# EAGLE design ESP-Breakout Bd (EAGLE 8.2.2)
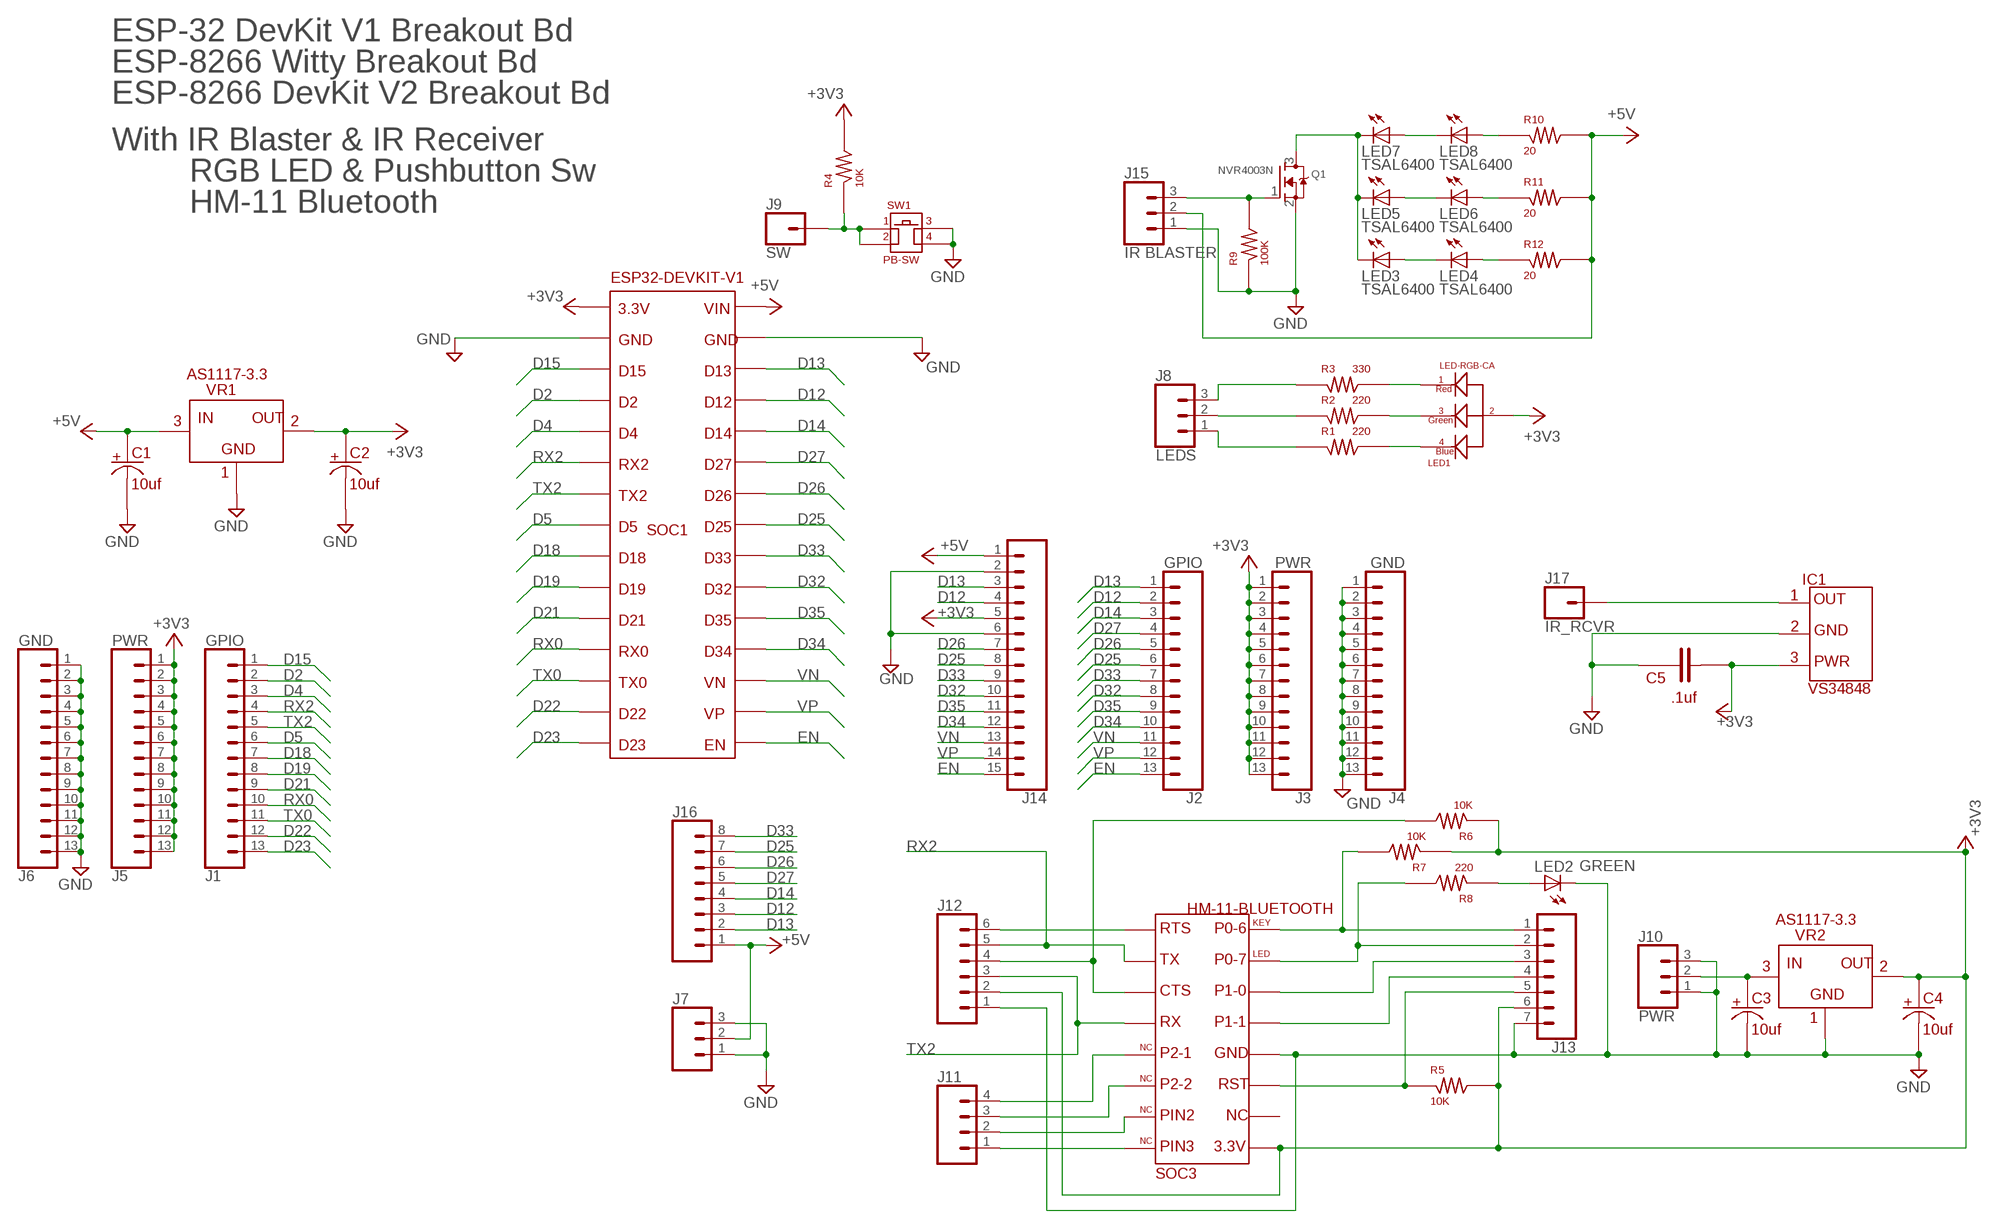
[diagram p0: schematic, sheet 1]

## Parts
C1  10uf  CAP-POL-SMT-B  [SMT-B]
C2  10uf  CAP-POL-SMT-B  [SMT-B]
C3  10uf  CAP-POL-SMT-B  [SMT-B]
C4  10uf  CAP-POL-SMT-B  [SMT-B]
C5  .1uf  NPCAP-2.5MM-ROUND  [CAP-2.5MM-ROUND]
IC1  VS34848  [VS34838]
J1  GPIO  CONN_13  [1X13]
J2  GPIO  CONN_13  [1X13]
J3  PWR  CONN_13  [1X13]
J4  GND  CONN_13  [1X13]
J5  PWR  CONN_13  [1X13]
J6  GND  CONN_13  [1X13]
J7  CONN_03  [1X03]
J8  LEDS  CONN_03  [1X03]
J9  SW  CONN_01  [1X01]
J10  PWR  CONN_03  [1X03]
J11  CONN_04  [1X04]
J12  CONN_06SILK_FEMALE_PTH  [1X06]
J13  CONN_07  [1X07]
J14  CONN_15  [1X15]
J15  IR BLASTER  CONN_03  [1X03]
J16  CONN_08"  [1X08]
J17  IR_RCVR  CONN_01  [1X01]
LED1  LED-RGB-CA  [LED-RGB-5MM]
LED2  GREEN  LEDCHIPLED_0805  [CHIPLED_0805]
LED3  TSAL6400  LED5MM  [LED5MM]
LED4  TSAL6400  LED5MM  [LED5MM]
LED5  TSAL6400  LED5MM  [LED5MM]
LED6  TSAL6400  LED5MM  [LED5MM]
LED7  TSAL6400  LED5MM  [LED5MM]
LED8  TSAL6400  LED5MM  [LED5MM]
Q1  NVR4003N  MOSFET-NREFLOW  [SOT23]
R1  220  RESISTOR-1206-TOP  [SMT-1206-TOP]
R2  220  RESISTOR-1206-TOP  [SMT-1206-TOP]
R3  330  RESISTOR-1206-TOP  [SMT-1206-TOP]
R4  10K  RESISTOR-1206-TOP  [SMT-1206-TOP]
R5  10K  RESISTOR-SMT-0603  [SMT-0603]
R6  10K  RESISTOR-SMT-0603  [SMT-0603]
R7  10K  RESISTOR-SMT-0603  [SMT-0603]
R8  220  RESISTOR-SMT-0603  [SMT-0603]
R9  100K  RESISTOR-SMT-0603  [SMT-0603]
R10  20  1/2WATT  [1/2WATT]
R11  20  1/2WATT  [1/2WATT]
R12  20  1/2WATT  [1/2WATT]
SOC1  ESP32-DEVKIT-V1  [ESP32-DEVKIT-V1]
SOC3  HM-11-BLUETOOTH  [HM-11]
SW1  PB-SW  [PB-SW]
VR1  AS1117-3.3  AS1117  [SOT-223]
VR2  AS1117-3.3  AS1117  [SOT-223]

## Nets
+3V3: C2.P$1 C4.P$1 C5.P$2 IC1.P$3 J3.1 J3.2 J3.3 J3.4 J3.5 J3.6 J3.7 J3.8 J3.9 J3.10 J3.11 J3.12 J3.13 J5.1 J5.2 J5.3 J5.4 J5.5 J5.6 J5.7 J5.8 J5.9 J5.10 J5.11 J5.12 J5.13 J12.2 J13.6 J14.5 LED1.P$2 R4.P$2 R5.P$2 R6.P$1 R7.P$1 SOC1.P$1 SOC3.P$9 VR1.P$2 VR1.P$4 VR2.P$2 VR2.P$4
+5V: C1.P$1 J7.2 J14.1 J15.2 J16.1 R10.P$2 R11.P$2 R12.P$2 SOC1.P$30 VR1.P$3
D2: J1.2 SOC1.P$4
D4: J1.3 SOC1.P$5
D5: J1.6 SOC1.P$8
D12: J2.2 J14.4 J16.3 SOC1.P$27
D13: J2.1 J14.3 J16.2 SOC1.P$28
D14: J2.3 J16.4 SOC1.P$26
D15: J1.1 SOC1.P$3
D18: J1.7 SOC1.P$9
D19: J1.8 SOC1.P$10
D21: J1.9 SOC1.P$11
D22: J1.12 SOC1.P$14
D23: J1.13 SOC1.P$15
D25: J2.6 J14.8 J16.7 SOC1.P$23
D26: J2.5 J14.7 J16.6 SOC1.P$24
D27: J2.4 J16.5 SOC1.P$25
D32: J2.8 J14.10 SOC1.P$21
D33: J2.7 J14.9 J16.8 SOC1.P$22
D34: J2.10 J14.12 SOC1.P$19
D35: J2.9 J14.11 SOC1.P$20
EN: J2.13 J14.15 SOC1.P$16
GND: C1.P$2 C2.P$2 C3.P$2 C4.P$2 C5.P$1 IC1.P$2 J4.1 J4.2 J4.3 J4.4 J4.5 J4.6 J4.7 J4.8 J4.9 J4.10 J4.11 J4.12 J4.13 J6.1 J6.2 J6.3 J6.4 J6.5 J6.6 J6.7 J6.8 J6.9 J6.10 J6.11 J6.12 J6.13 J7.1 J7.3 J10.1 J10.3 J12.1 J13.7 J14.2 J14.6 J15.1 LED2.C Q1.2(S) R9.P$1 SOC1.P$2 SOC1.P$29 SOC3.P$12 SW1.P$3 SW1.P$4 VR1.P$1 VR2.P$1
N$1: C3.P$1 J10.2 VR2.P$3
N$2: J13.5 R5.P$1 SOC3.P$11
N$3: IC1.P$1 J17.1
N$4: J13.1 R7.P$2 SOC3.P$16
N$5: J13.2 R8.P$2 SOC3.P$15
N$6: J12.4 R6.P$2 SOC3.P$3
N$7: J12.6 SOC3.P$1
N$8: J11.1 SOC3.P$8
N$9: J11.2 SOC3.P$7
N$10: J11.3 SOC3.P$6
N$11: J11.4 SOC3.P$5
N$12: J15.3 Q1.1(G) R9.P$2
N$14: J13.3 SOC3.P$14
N$15: J13.4 SOC3.P$13
N$17: LED2.A R8.P$1
N$19: LED7.A LED8.K(C)
N$20: LED5.A LED6.K(C)
N$21: LED3.A LED4.K(C)
N$22: LED3.K(C) LED5.K(C) LED7.K(C) Q1.3(D)
N$23: LED8.A R10.P$1
N$25: J9.1 R4.P$1 SW1.P$1 SW1.P$2
N$26: J8.2 R2.P$1
N$27: LED1.P$3 R2.P$2
N$28: LED1.P$1 R3.P$2
N$29: J8.3 R3.P$1
N$30: J8.1 R1.P$1
N$31: LED1.P$4 R1.P$2
N$32: LED6.A R11.P$1
N$33: LED4.A R12.P$1
RX0: J1.10 SOC1.P$12
RX2: J1.4 J12.5 SOC1.P$6 SOC3.P$2
TX0: J1.11 SOC1.P$13
TX2: J1.5 J12.3 SOC1.P$7 SOC3.P$4
VN: J2.11 J14.13 SOC1.P$18
VP: J2.12 J14.14 SOC1.P$17
Unconnected: SOC3.P$10

## Notes on the sheet
- ESP-32 DevKit V1 Breakout Bd
- ESP-8266 Witty Breakout Bd
- ESP-8266 DevKit V2 Breakout Bd
- With IR Blaster & IR Receiver
- RGB LED & Pushbutton Sw
- HM-11 Bluetooth

## Library data of the parts
C1-C4 = me:CAP-POL-SMT-B
C5 = me:NPCAP-2.5MM-ROUND
IC1 = me:VS34848
J1-J6 = SparkFun-Connectors:CONN_13: Multi connection point. Often used as Generic Header-pin footprint for 0.1 inch spaced/style header connections On any of the 0.1 inch spaced packages, you can populate with these: Break Away Headers - Straight <https://www.sparkfun.com/products/116> (PRT-00116) Break Away Male Headers - Right Angle <https://www.sparkfun.com/products/553> (PRT-00553) Female Headers <https://www.sparkfun.com/products/115> (PRT-00115) Break Away Headers - Machine Pin <https://www.sparkfun.com/products/117> (PRT-00117) Break Away Female Headers - Swiss Machine Pin <https://www.sparkfun.com/products/743> (PRT-00743) For SCREWTERMINALS and SPRING TERMINALS visit here: Screw Terimnals on SparkFun.com <https://www.sparkfun.com/search/results?term=Screw+Terminals> (5mm/3.5mm/2.54mm spacing) This device is also useful as a general connection point to wire up your design to another part of your project. Our various solder wires solder well into these plated through hole pads. Hook-Up Wire - Assortment (Stranded, 22 AWG) <https://www.sparkfun.com/products/11375> (PRT-11375) Hook-Up Wire - Assortment (Solid Core, 22 AWG) <https://www.sparkfun.com/products/11367> (PRT-11367) View the entire wire category on our website here <https://www.sparkfun.com/categories/141> Special notes: Molex polarized connector foot print use with SKU : PRT-08231 with associated crimp pins and housings. 1MM SMD Version SKU: PRT-10208 NOTES ON THE VARIANTS LOCK and LOCK_LONGPADS... This footprint was designed to help hold the alignment of a through-hole component (i.e. 6-pin header) while soldering it into place. You may notice that each hole has been shifted either up or down by 0.005 of an inch from it's more standard position (which is a perfectly straight line). This slight alteration caused the pins (the squares in the middle) to touch the edges of the holes. Because they are alternating, it causes a "brace" to hold the component in place. 0.005 has proven to be the perfect amount of "off-center" position when using our standard breakaway headers. Although looks a little odd when you look at the bare footprint, once you have a header in there, the alteration is very hard to notice. Also,if you push a header all the way into place, it is covered up entirely on the bottom side.
J7 J8 J10 J15 = SparkFun-Connectors:CONN_03: Multi connection point. Often used as Generic Header-pin footprint for 0.1 inch spaced/style header connections On any of the 0.1 inch spaced packages, you can populate with these: Break Away Headers - Straight <https://www.sparkfun.com/products/116> (PRT-00116) Break Away Male Headers - Right Angle <https://www.sparkfun.com/products/553> (PRT-00553) Female Headers <https://www.sparkfun.com/products/115> (PRT-00115) Break Away Headers - Machine Pin <https://www.sparkfun.com/products/117> (PRT-00117) Break Away Female Headers - Swiss Machine Pin <https://www.sparkfun.com/products/743> (PRT-00743) Stackable Header - 3 Pin (Female, 0.1") <https://www.sparkfun.com/products/13875> (PRT-13875) For SCREWTERMINALS and SPRING TERMINALS visit here: Screw Terimnals on SparkFun.com <https://www.sparkfun.com/search/results?term=Screw+Terminals> (5mm/3.5mm/2.54mm spacing) This device is also useful as a general connection point to wire up your design to another part of your project. Our various solder wires solder well into these plated through hole pads. Hook-Up Wire - Assortment (Stranded, 22 AWG) <https://www.sparkfun.com/products/11375> (PRT-11375) Hook-Up Wire - Assortment (Solid Core, 22 AWG) <https://www.sparkfun.com/products/11367> (PRT-11367) View the entire wire category on our website here <https://www.sparkfun.com/categories/141> Special notes: Molex polarized connector foot print use with SKU : PRT-08232 with associated crimp pins and housings.
J9 J17 = SparkFun-Connectors:CONN_01: Single connection point. Often used as Generic Header-pin footprint for 0.1 inch spaced/style header connections On any of the 0.1 inch spaced packages, you can populate with these: Break Away Headers - Straight <https://www.sparkfun.com/products/116> (PRT-00116) Break Away Male Headers - Right Angle <https://www.sparkfun.com/products/553> (PRT-00553) Female Headers <https://www.sparkfun.com/products/115> (PRT-00115) Break Away Headers - Machine Pin <https://www.sparkfun.com/products/117> (PRT-00117) Break Away Female Headers - Swiss Machine Pin <https://www.sparkfun.com/products/743> (PRT-00743) This device is also useful as a general connection point to wire up your design to another part of your project. Our various solder wires solder well into these plated through hole pads. Hook-Up Wire - Assortment (Stranded, 22 AWG) <https://www.sparkfun.com/products/11375> (PRT-11375) Hook-Up Wire - Assortment (Solid Core, 22 AWG) <https://www.sparkfun.com/products/11367> (PRT-11367) View the entire wire category on our website here <https://www.sparkfun.com/categories/141> Special notes: SMTSO-256-ET is a "flush mount" nut for a 4-40 screw. We mostly use this on specialty testbeds; it is a nice way to connect hardware to your PCB at an adjustable hieght. Also note, the SNAP packages are for using a snappable style connector. We sell a baggie of snaps and they are also used on two LilyPad designs: Snap Assortment - 30 pack (male and female) <https://www.sparkfun.com/products/11347> (DEV-11347) LilyPad Arduino SimpleSnap <https://www.sparkfun.com/products/10941> (DEV-10941) LilyPad SimpleSnap Protoboard <https://www.sparkfun.com/products/10940> (DEV-10940)
J11 = SparkFun-Connectors:CONN_04: Multi connection point. Often used as Generic Header-pin footprint for 0.1 inch spaced/style header connections On any of the 0.1 inch spaced packages, you can populate with these: Break Away Headers - Straight <https://www.sparkfun.com/products/116> (PRT-00116) Break Away Male Headers - Right Angle <https://www.sparkfun.com/products/553> (PRT-00553) Female Headers <https://www.sparkfun.com/products/115> (PRT-00115) Break Away Headers - Machine Pin <https://www.sparkfun.com/products/117> (PRT-00117) Break Away Female Headers - Swiss Machine Pin <https://www.sparkfun.com/products/743> (PRT-00743) For SCREWTERMINALS and SPRING TERMINALS visit here: Screw Terimnals on SparkFun.com <https://www.sparkfun.com/search/results?term=Screw+Terminals> (5mm/3.5mm/2.54mm spacing) This device is also useful as a general connection point to wire up your design to another part of your project. Our various solder wires solder well into these plated through hole pads. Hook-Up Wire - Assortment (Stranded, 22 AWG) <https://www.sparkfun.com/products/11375> (PRT-11375) Hook-Up Wire - Assortment (Solid Core, 22 AWG) <https://www.sparkfun.com/products/11367> (PRT-11367) View the entire wire category on our website here <https://www.sparkfun.com/categories/141> Special notes: Molex polarized connector foot print use with SKU : PRT-08231 with associated crimp pins and housings. 1MM SMD Version SKU: PRT-10208; PROD_ID: CONN-09696
J12 = SparkFun-Connectors:CONN_06: Multi connection point. Often used as Generic Header-pin footprint for 0.1 inch spaced/style header connections On any of the 0.1 inch spaced packages, you can populate with these: Break Away Headers - Straight <https://www.sparkfun.com/products/116> (PRT-00116) Break Away Male Headers - Right Angle <https://www.sparkfun.com/products/553> (PRT-00553) Female Headers <https://www.sparkfun.com/products/115> (PRT-00115) Break Away Headers - Machine Pin <https://www.sparkfun.com/products/117> (PRT-00117) Break Away Female Headers - Swiss Machine Pin <https://www.sparkfun.com/products/743> (PRT-00743) Arduino Stackable Header - 6 Pin <https://www.sparkfun.com/products/9280> (PRT-09280) For SCREWTERMINALS and SPRING TERMINALS visit here: Screw Terimnals on SparkFun.com <https://www.sparkfun.com/search/results?term=Screw+Terminals> (5mm/3.5mm/2.54mm spacing) This device is also useful as a general connection point to wire up your design to another part of your project. Our various solder wires solder well into these plated through hole pads. Hook-Up Wire - Assortment (Stranded, 22 AWG) <https://www.sparkfun.com/products/11375> (PRT-11375) Hook-Up Wire - Assortment (Solid Core, 22 AWG) <https://www.sparkfun.com/products/11367> (PRT-11367) View the entire wire category on our website here <https://www.sparkfun.com/categories/141>; PROD_ID: CONN-08437
J13 = SparkFun-Connectors:CONN_07: Multi connection point. Often used as Generic Header-pin footprint for 0.1 inch spaced/style header connections On any of the 0.1 inch spaced packages, you can populate with these: Break Away Headers - Straight <https://www.sparkfun.com/products/116> (PRT-00116) Break Away Male Headers - Right Angle <https://www.sparkfun.com/products/553> (PRT-00553) Female Headers <https://www.sparkfun.com/products/115> (PRT-00115) Break Away Headers - Machine Pin <https://www.sparkfun.com/products/117> (PRT-00117) Break Away Female Headers - Swiss Machine Pin <https://www.sparkfun.com/products/743> (PRT-00743) For SCREWTERMINALS and SPRING TERMINALS visit here: Screw Terimnals on SparkFun.com <https://www.sparkfun.com/search/results?term=Screw+Terminals> (5mm/3.5mm/2.54mm spacing) This device is also useful as a general connection point to wire up your design to another part of your project. Our various solder wires solder well into these plated through hole pads. Hook-Up Wire - Assortment (Stranded, 22 AWG) <https://www.sparkfun.com/products/11375> (PRT-11375) Hook-Up Wire - Assortment (Solid Core, 22 AWG) <https://www.sparkfun.com/products/11367> (PRT-11367) View the entire wire category on our website here <https://www.sparkfun.com/categories/141> Special notes: Molex polarized connector foot print use with SKU : PRT-08231 with associated crimp pins and housings. 1MM SMD Version SKU: PRT-10208 NOTES ON THE VARIANTS LOCK and LOCK_LONGPADS... This footprint was designed to help hold the alignment of a through-hole component (i.e. 6-pin header) while soldering it into place. You may notice that each hole has been shifted either up or down by 0.005 of an inch from it's more standard position (which is a perfectly straight line). This slight alteration caused the pins (the squares in the middle) to touch the edges of the holes. Because they are alternating, it causes a "brace" to hold the component in place. 0.005 has proven to be the perfect amount of "off-center" position when using our standard breakaway headers. Although looks a little odd when you look at the bare footprint, once you have a header in there, the alteration is very hard to notice. Also,if you push a header all the way into place, it is covered up entirely on the bottom side.
J14 = SparkFun-Connectors:CONN_15: Multi connection point. Often used as Generic Header-pin footprint for 0.1 inch spaced/style header connections On any of the 0.1 inch spaced packages, you can populate with these: Break Away Headers - Straight <https://www.sparkfun.com/products/116> (PRT-00116) Break Away Male Headers - Right Angle <https://www.sparkfun.com/products/553> (PRT-00553) Female Headers <https://www.sparkfun.com/products/115> (PRT-00115) Break Away Headers - Machine Pin <https://www.sparkfun.com/products/117> (PRT-00117) Break Away Female Headers - Swiss Machine Pin <https://www.sparkfun.com/products/743> (PRT-00743) For SCREWTERMINALS and SPRING TERMINALS visit here: Screw Terimnals on SparkFun.com <https://www.sparkfun.com/search/results?term=Screw+Terminals> (5mm/3.5mm/2.54mm spacing) This device is also useful as a general connection point to wire up your design to another part of your project. Our various solder wires solder well into these plated through hole pads. Hook-Up Wire - Assortment (Stranded, 22 AWG) <https://www.sparkfun.com/products/11375> (PRT-11375) Hook-Up Wire - Assortment (Solid Core, 22 AWG) <https://www.sparkfun.com/products/11367> (PRT-11367) View the entire wire category on our website here <https://www.sparkfun.com/categories/141> Special notes: Molex polarized connector foot print use with SKU : PRT-08231 with associated crimp pins and housings. 1MM SMD Version SKU: PRT-10208 NOTES ON THE VARIANTS LOCK and LOCK_LONGPADS... This footprint was designed to help hold the alignment of a through-hole component (i.e. 6-pin header) while soldering it into place. You may notice that each hole has been shifted either up or down by 0.005 of an inch from it's more standard position (which is a perfectly straight line). This slight alteration caused the pins (the squares in the middle) to touch the edges of the holes. Because they are alternating, it causes a "brace" to hold the component in place. 0.005 has proven to be the perfect amount of "off-center" position when using our standard breakaway headers. Although looks a little odd when you look at the bare footprint, once you have a header in there, the alteration is very hard to notice. Also,if you push a header all the way into place, it is covered up entirely on the bottom side.
J16 = SparkFun-Connectors:CONN_08: Multi connection point. Often used as Generic Header-pin footprint for 0.1 inch spaced/style header connections On any of the 0.1 inch spaced packages, you can populate with these: Break Away Headers - Straight <https://www.sparkfun.com/products/116> (PRT-00116) Break Away Male Headers - Right Angle <https://www.sparkfun.com/products/553> (PRT-00553) Female Headers <https://www.sparkfun.com/products/115> (PRT-00115) Break Away Headers - Machine Pin <https://www.sparkfun.com/products/117> (PRT-00117) Break Away Female Headers - Swiss Machine Pin <https://www.sparkfun.com/products/743> (PRT-00743) Arduino Stackable Header - 8 Pin <https://www.sparkfun.com/products/9279> (PRT-09279) For SCREWTERMINALS and SPRING TERMINALS visit here: Screw Terimnals on SparkFun.com <https://www.sparkfun.com/search/results?term=Screw+Terminals> (5mm/3.5mm/2.54mm spacing) This device is also useful as a general connection point to wire up your design to another part of your project. Our various solder wires solder well into these plated through hole pads. Hook-Up Wire - Assortment (Stranded, 22 AWG) <https://www.sparkfun.com/products/11375> (PRT-11375) Hook-Up Wire - Assortment (Solid Core, 22 AWG) <https://www.sparkfun.com/products/11367> (PRT-11367) View the entire wire category on our website here <https://www.sparkfun.com/categories/141> Special notes: Molex polarized connector foot print use with SKU : PRT-08231 with associated crimp pins and housings. 1MM SMD Version SKU: PRT-10208 NOTES ON THE VARIANTS LOCK and LOCK_LONGPADS... This footprint was designed to help hold the alignment of a through-hole component (i.e. 6-pin header) while soldering it into place. You may notice that each hole has been shifted either up or down by 0.005 of an inch from it's more standard position (which is a perfectly straight line). This slight alteration caused the pins (the squares in the middle) to touch the edges of the holes. Because they are alternating, it causes a "brace" to hold the component in place. 0.005 has proven to be the perfect amount of "off-center" position when using our standard breakaway headers. Although looks a little odd when you look at the bare footprint, once you have a header in there, the alteration is very hard to notice. Also,if you push a header all the way into place, it is covered up entirely on the bottom side.; PROD_ID: CONN-08438
LED1 = me:LED-RGB-CA
LED2-LED8 = adafruit:LED: LED OSRAM: - CHIPLED LG R971, LG N971, LY N971, LG Q971, LY Q971, LO R971, LY R971 LH N974, LH R974 LS Q976, LO Q976, LY Q976 LO Q996 - Hyper CHIPLED LW Q18S LB Q993, LB Q99A, LB R99A - SideLED LS A670, LO A670, LY A670, LG A670, LP A670 LB A673, LV A673, LT A673, LW A673 LH A674 LY A675 LS A676, LA A676, LO A676, LY A676, LW A676 LS A679, LY A679, LG A679 - Hyper Micro SIDELED® LS Y876, LA Y876, LO Y876, LY Y876 LT Y87S - SmartLED LW L88C, LW L88S LB L89C, LB L89S, LG L890 LS L89K, LO L89K, LY L89K LS L896, LA L896, LO L896, LY L896 - TOPLED LS T670, LO T670, LY T670, LG T670, LP T670 LSG T670, LSP T670, LSY T670, LOP T670, LYG T670 LG T671, LOG T671, LSG T671 LB T673, LV T673, LT T673, LW T673 LH T674 LS T676, LA T676, LO T676, LY T676, LB T676, LH T676, LSB T676, LW T676 LB T67C, LV T67C, LT T67C, LS T67K, LO T67K, LY T67K, LW E67C LS E67B, LA E67B, LO E67B, LY E67B, LB E67C, LV E67C, LT E67C LW T67C LS T679, LY T679, LG T679 LS T770, LO T770, LY T770, LG T770, LP T770 LB T773, LV T773, LT T773, LW T773 LH T774 LS E675, LA E675, LY E675, LS T675 LS T776, LA T776, LO T776, LY T776, LB T776 LHGB T686 LT T68C, LB T68C - Hyper Mini TOPLED® LB M676 - Mini TOPLED Santana® LG M470 LS M47K, LO M47K, LY M47K Source: http://www.osram.convergy.de/
Q1 = adafruit:MOSFET-N: N-Channel Mosfet 2N7002E - 60V 260mA SOT23 [Digikey: 2N7002ET1GOSTR-ND] - REEL BSH103 - 30V 850mA SOT23 [Digikey: 568-5013-1-ND]
R1-R4 = me:RESISTOR-1206-TOP
R5-R9 = me:RESISTOR-SMT-0603
R10-R12 = me:1/2WATT
SOC1 = me:ESP32-DEVKIT-V1
SOC3 = me:HM-11-BLUETOOTH
SW1 = me:PB-SW
VR1 VR2 = me:AS1117

## Board
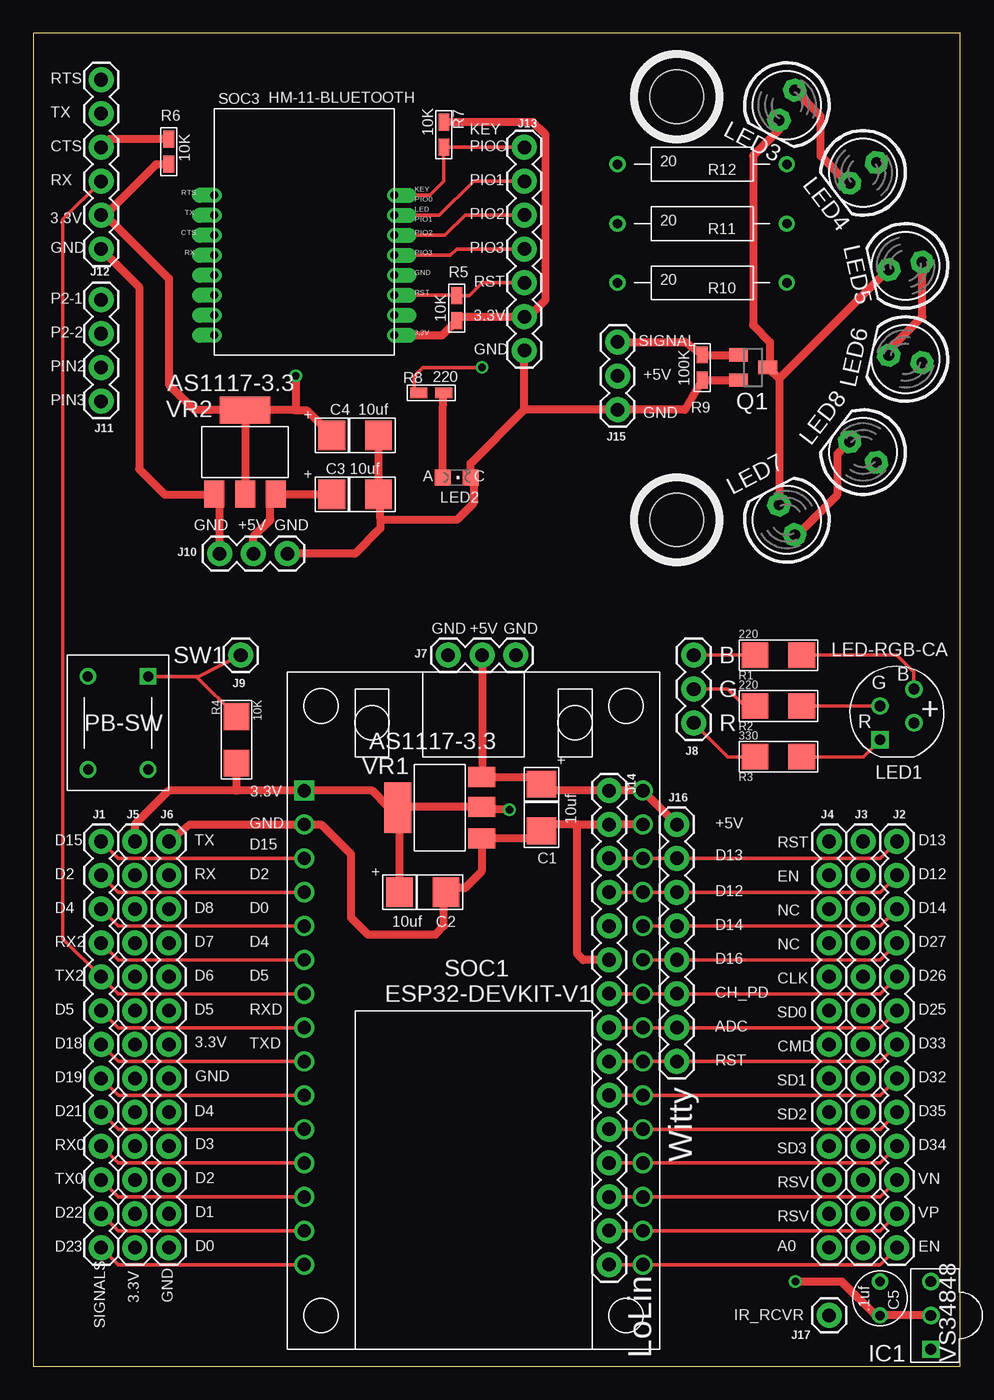
[diagram p1: board, top side]
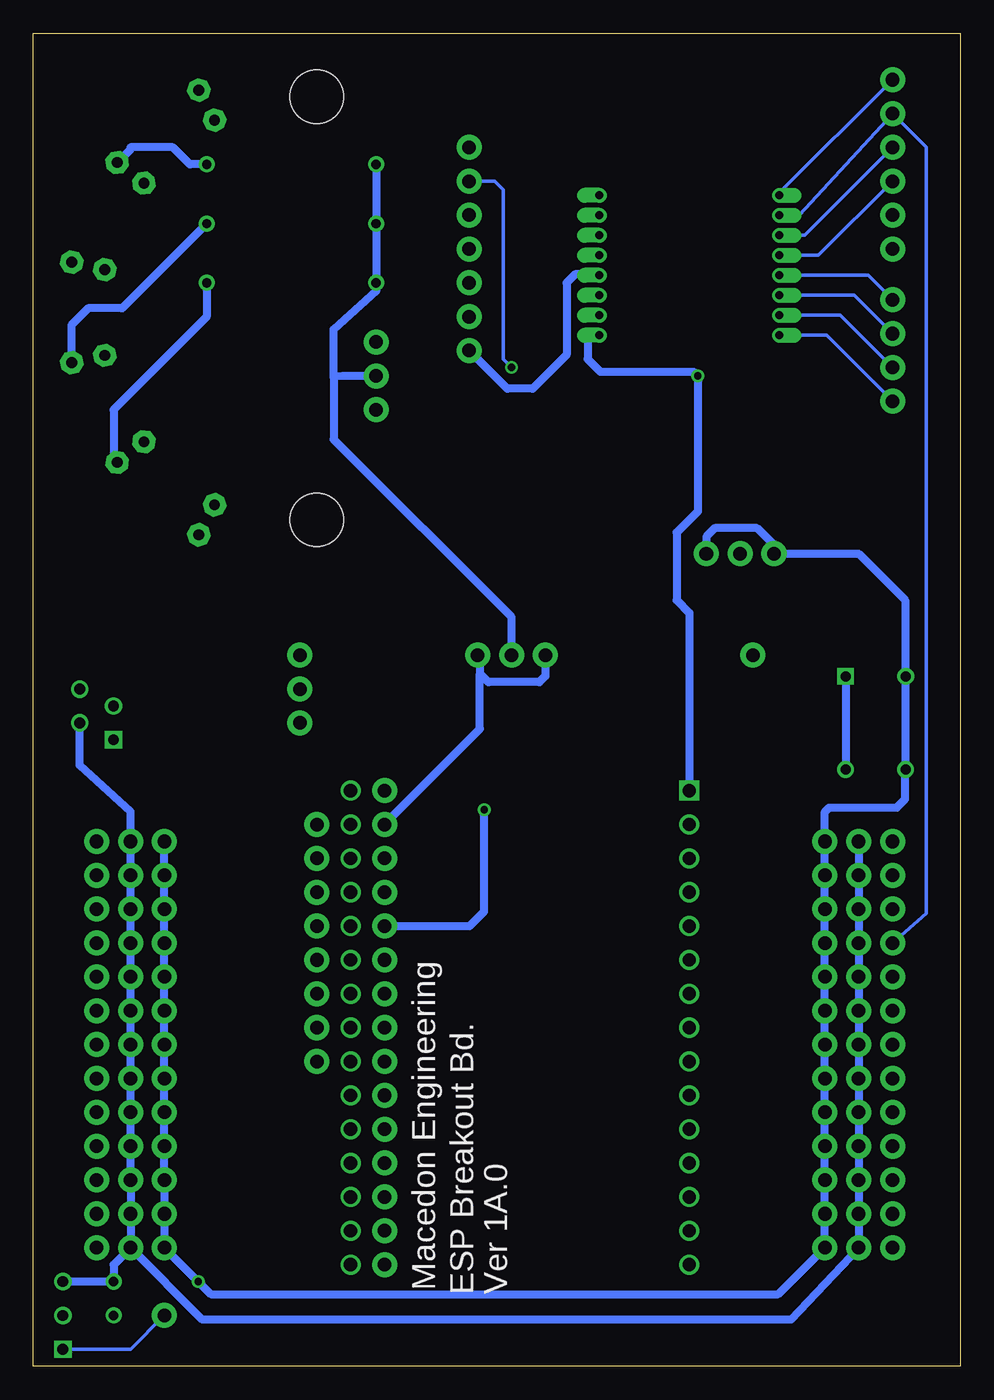
[diagram p2: board, bottom side, seen from below]

Size 69.52 x 100 mm. Coordinates in mm from the lower left corner, seen from the top.
Outline: 0,0 69.52,0 69.52,100 0,100 0,0
Copper layers (1*16): Top 0.035mm / dielectric 1.5mm / Bottom 0.035mm
Design rules "default": minimum track width 6mil, minimum drill 0.35mm, track to track 6mil, track to pad 6mil, pad to pad 6mil, via to via 6mil, smd to smd 6mil, copper to edge 40mil, drill to drill 6mil, minimum pad ring 10mil, minimum via ring 8mil, stop-mask expansion 4mil, vias tented up to drill 0mil, thermal gap 10mil
Holes 4 mm at 48.26,95.25 48.26,63.5

### Footprints (pad centres in the part's own frame; a part is rotated, then mirrored left to right if it is on the bottom)
SMT-B = smd 2 x 2.2: P$1 -1.75,0; P$2 1.75,0
CAP-2.5MM-ROUND = drill 0.7: P$1 -1.27,0; P$2 1.27,0
VS34838 = drill 0.8 square: P$1 -2.54,0 | drill 0.8: P$2 0,0; P$3 2.54,0
1X13 = drill 1.016 pad 1.88: 1 0,0; 2 2.54,0; 3 5.08,0; 4 7.62,0; 5 10.16,0; 6 12.7,0; 7 15.24,0; 8 17.78,0; 9 20.32,0; 10 22.86,0; 11 25.4,0; 12 27.94,0; 13 30.48,0
1X03 = drill 1.016 pad 1.88: 1 0,0; 2 2.54,0; 3 5.08,0
1X01 = drill 1.016 pad 1.88: 1 0,0
1X04 = drill 1.016 pad 1.88: 1 0,0; 2 2.54,0; 3 5.08,0; 4 7.62,0
1X06 = drill 1.016 pad 1.88: 1 0,0; 2 2.54,0; 3 5.08,0; 4 7.62,0; 5 10.16,0; 6 12.7,0
1X07 = drill 1.016 pad 1.88: 1 0,0; 2 2.54,0; 3 5.08,0; 4 7.62,0; 5 10.16,0; 6 12.7,0; 7 15.24,0
1X15 = drill 1.016 pad 1.88: 1 0,0; 2 2.54,0; 3 5.08,0; 4 7.62,0; 5 10.16,0; 6 12.7,0; 7 15.24,0; 8 17.78,0; 9 20.32,0; 10 22.86,0; 11 25.4,0; 12 27.94,0; 13 30.48,0; 14 33.02,0; 15 35.56,0
1X08 = drill 1.016 pad 1.88: 1 0,0; 2 2.54,0; 3 5.08,0; 4 7.62,0; 5 10.16,0; 6 12.7,0; 7 15.24,0; 8 17.78,0
LED-RGB-5MM = drill 0.8 square: P$1 -1.27,-2.54 | drill 0.8: P$2 1.27,-1.27; P$3 -1.27,0; P$4 1.27,1.27
CHIPLED_0805 = smd 1.2 x 1.2: A 0,-1.05; C 0,1.05
LED5MM = drill 0.813 pad 1.676 octagon: A -1.27,0; K 1.27,0
SOT23 = smd 1 x 1.4: 1 -0.95,-1.1; 2 0.95,-1.1; 3 0,1.1
SMT-1206-TOP = smd 2 x 1.9: P$1 -1.75,0; P$2 1.75,0
SMT-0603 = smd 1.27 x 0.8: P$1 -0.945,0; P$2 0.945,0
1/2WATT = drill 0.7: P$1 -6.35,0; P$2 6.35,0
ESP32-DEVKIT-V1 = drill 1 square: P$1 -12.7,17.78 | drill 1: P$2 -12.7,15.24; P$3 -12.7,12.7; P$4 -12.7,10.16; P$5 -12.7,7.62; P$6 -12.7,5.08; P$7 -12.7,2.54; P$8 -12.7,0; P$9 -12.7,-2.54; P$10 -12.7,-5.08; P$11 -12.7,-7.62; P$12 -12.7,-10.16; P$13 -12.7,-12.7; P$14 -12.7,-15.24; P$15 -12.7,-17.78; P$16 12.7,-17.78; P$17 12.7,-15.24; P$18 12.7,-12.7; P$19 12.7,-10.16; P$20 12.7,-7.62; P$21 12.7,-5.08; P$22 12.7,-2.54; P$23 12.7,0; P$24 12.7,2.54; P$25 12.7,5.08; P$26 12.7,7.62; P$27 12.7,10.16; P$28 12.7,12.7; P$29 12.7,15.24; P$30 12.7,17.78
HM-11 = drill 0.6 pad 0.9 offset: P$1 -6.75,2.75; P$2 -6.75,1.25; P$3 -6.75,-0.25; P$4 -6.75,-1.75; P$5 -6.75,-3.25; P$6 -6.75,-4.75; P$7 -6.75,-6.25; P$8 -6.75,-7.75; P$9 6.75,-7.75; P$10 6.75,-6.25; P$11 6.75,-4.75; P$12 6.75,-3.25; P$13 6.75,-1.75; P$14 6.75,-0.25; P$15 6.75,1.25; P$16 6.75,2.75
PB-SW = drill 0.75 square: P$1 -3.5,2.25 | drill 0.75: P$2 3.5,2.25; P$3 -3.5,-2.258; P$4 3.5,-2.25
SOT-223 = smd 1.5 x 2: P$1 -2.3,-3.15; P$2 0.03,-3.15; P$3 2.3,-3.15 | smd 3.8 x 2: P$4 0,3.15

### Placement (x,y rotation side)
C1  38.1,41.91 270 top
C2  29.21,35.56 0 top
C3  24.13,65.41 0 top
C4  24.13,69.85 0 top
C5  63.5,5.08 90 top
IC1  67.31,3.81 90 top
J1  5.08,39.37 270 top
J2  64.77,39.37 270 top
J3  62.23,39.37 270 top
J4  59.69,39.37 270 top
J5  7.62,39.37 270 top
J6  10.16,39.37 270 top
J7  31.11,53.34 0 top
J8  49.53,53.34 270 top
J9  15.56,53.34 0 top
J10  13.97,60.96 0 top
J11  5.08,72.39 90 top
J12  5.08,83.82 90 top
J13  36.83,91.44 270 top
J14  43.18,43.18 270 top
J15  43.81,71.75 90 top
J16  48.26,40.64 270 top
J17  59.69,3.81 0 top
LED1  64.77,49.53 0 top
LED2  31.75,66.67 270 top
LED3  56.52,94.61 242.5 top
LED4  62.23,89.53 217.5 top
LED5  65.41,82.55 192.5 top
LED6  65.41,75.56 167.5 top
LED7  56.52,63.5 117.5 top
LED8  62.23,68.58 142.5 top
Q1  53.98,74.93 270 top
R1  55.88,53.34 0 top
R2  55.88,49.53 0 top
R3  55.88,45.72 0 top
R4  15.24,46.99 270 top
R5  31.75,79.38 270 top
R6  10.16,91.12 90 top
R7  30.8,92.39 270 top
R8  29.84,73.03 180 top
R9  50.16,74.93 90 top
R10  50.16,81.28 180 top
R11  50.16,85.72 180 top
R12  50.16,90.17 180 top
SOC1  33.02,25.4 0 top
SOC3  20.32,85.09 0 top
SW1  6.35,48.26 270 top
VR1  30.48,41.91 90 top
VR2  15.88,68.58 0 top

### Tracks (layer width: path | path; a pad name or v marks a point on that pad's centre or on a via)
+3V3  (via drill 0.55)
  Top 0.254: R5.P$2 31.43,78.11
  Top 0.61: VR2.P$2 15.9,71.7 VR2.P$4 | 19.63,71.73 VR2.P$4 | 19.63,71.73 20.5,71.73 C4.P$1 | SOC3.P$9 30.66,77.34 R5.P$2 32.06,78.74 J13.6 37.15,78.74 38.42,80.01 38.42,92.39 37.47,93.34 R7.P$1 | v19.68,74.3 19.68,71.79 19.63,71.73 | 27.46,41.78 C2.P$1 | 27.46,41.78 VR1.P$4 26.67,41.91 25.4,43.18 SOC1.P$1 15.24,43.18 | 15.24,43.18 R4.P$2 | 15.24,43.18 10.16,43.18 7.62,40.64 J5.1 | 5.4,86.36 9.21,90.17 R6.P$1 | J12.2 5.4,86.36 | 5.4,86.36 10.16,81.6 10.16,73.66 12.06,71.75 15.85,71.75 VR2.P$4 | 27.46,41.78 27.62,41.94 VR1.P$2 33.81,41.76 v35.7,41.76
  Bottom 0.61: J5.1 J5.2 J5.3 J5.4 J5.5 J5.6 J5.7 J5.8 J5.9 J5.10 J5.11 J5.12 J5.13 12.7,3.49 56.83,3.49 J3.13 | LED1.P$2 66.04,45.09 62.23,41.59 J3.1 J3.2 J3.3 J3.4 J3.5 J3.6 J3.7 J3.8 J3.9 J3.10 J3.11 J3.12 J3.13 | SOC1.P$1 20.32,56.52 21.27,57.47 21.27,62.55 19.68,64.14 v19.68,74.3 20,74.61 26.99,74.61 27.94,75.56 27.94,77.15 27.75,77.34 SOC3.P$9 | J14.5 36.79,33.02 35.7,34.11 v35.7,41.76 | IC1.P$3 C5.P$2 63.5,7.62 J3.13
+5V
  Top 0.61: 33.66,44.21 37.55,44.21 C1.P$1 38.58,43.18 J14.1 SOC1.P$30 J16.1 | 33.66,44.21 VR1.P$3 | J7.2 33.66,44.22 33.66,44.21
  Bottom 0.61: R12.P$2 R11.P$2 R10.P$2 43.81,80.64 46.99,77.79 46.99,74.23 | 46.99,74.23 46.99,69.53 33.66,56.2 J7.2 | 46.99,74.23 46.29,74.3 J15.2
D2
  Top 0.254: J1.2 6.35,35.56 SOC1.P$4
D4
  Top 0.254: J1.3 6.35,33.02 SOC1.P$5
D5
  Top 0.254: J1.6 6.35,25.4 SOC1.P$8
D12
  Top 0.254: 45.83,35.56 J16.3 63.5,35.56 J2.2 | 45.83,35.56 SOC1.P$27 | J14.4 45.83,35.56
D13
  Top 0.254: J2.1 63.5,38.1 J16.2 SOC1.P$28 J14.3
D14
  Top 0.254: J2.3 63.5,33.02 J16.4 SOC1.P$26
D15
  Top 0.254: J1.1 6.35,38.1 SOC1.P$3
D18
  Top 0.254: J1.7 6.35,22.86 SOC1.P$9
D19
  Top 0.254: J1.8 6.35,20.32 SOC1.P$10
D21
  Top 0.254: J1.9 6.35,17.78 SOC1.P$11
D22
  Top 0.254: J1.12 6.35,10.16 SOC1.P$14
D23
  Top 0.254: J1.13 6.35,7.62 SOC1.P$15
D25
  Top 0.254: J2.6 63.5,25.4 J16.7 SOC1.P$23 J14.8
D26
  Top 0.254: J2.5 63.5,27.94 J16.6 SOC1.P$24 J14.7
D27
  Top 0.254: J2.4 63.5,30.48 J16.5 SOC1.P$25
D32
  Top 0.254: J2.8 63.5,20.32 SOC1.P$21 J14.10
D33
  Top 0.254: J2.7 63.5,22.86 J16.8 SOC1.P$22 J14.9
D34
  Top 0.254: J2.10 63.5,15.24 SOC1.P$19 J14.12
D35
  Top 0.254: J2.9 63.5,17.78 45.83,17.78 | 45.83,17.78 SOC1.P$20 | J14.11 45.83,17.78
EN
  Top 0.254: 45.9,7.62 SOC1.P$16 | 45.9,7.62 63.5,7.62 J2.13 | J14.15 45.9,7.62
GND  (via drill 0.55)
  Top 0.61: J10.1 13.97,65.03 VR2.P$1 13.55,65.41 9.84,65.41 7.94,67.31 7.94,80.96 J12.1 | J10.3 24.13,60.96 26.04,62.87 26.04,63.59 | 26.04,63.59 26.04,65.25 C3.P$2 C4.P$2 25.4,70.33 | 36.83,71.82 36.83,71.75 32.8,67.72 LED2.C 33.02,66.45 33.02,64.77 31.75,63.5 26.13,63.5 26.04,63.59 | 36.83,71.82 J13.7 | Q1.2 R9.P$1 48.89,71.75 J15.1 36.89,71.75 36.83,71.82 | J6.1 11.75,40.64 SOC1.P$2 21.59,40.64 23.81,38.42 23.81,33.66 25.08,32.38 30.16,32.38 30.8,33.02 30.8,35.4 C2.P$2 31.28,35.88 32.38,35.88 33.63,37.12 VR1.P$1 37.55,39.61 C1.P$2 38.58,40.64 40.92,40.64 | SOC1.P$29 J14.2 40.92,40.64 | J14.6 41.24,30.48 40.8,30.92 40.8,40.52 40.92,40.64 | IC1.P$2 C5.P$1 63.18,3.81 60.64,6.35 v57.15,6.35
  Bottom 0.61: J10.3 19.05,62.23 18.41,62.87 15.24,62.87 13.97,61.59 J10.1 7.62,60.96 4.13,57.47 4.13,51.78 SW1.P$3 | SOC3.P$12 28.5,81.84 28.57,81.92 28.89,81.92 29.53,81.28 29.53,75.88 32.07,73.34 33.97,73.34 J13.7 | J4.1 J4.2 J4.3 J4.4 J4.5 J4.6 J4.7 J4.8 J4.9 J4.10 J4.11 J4.12 J4.13 v57.15,6.35 56.2,5.4 13.65,5.4 J6.13 J6.12 J6.11 J6.10 J6.9 J6.8 J6.7 J6.6 J6.5 J6.4 J6.3 J6.2 J6.1 10.16,41.59 9.84,41.91 4.76,41.91 4.13,42.55 4.13,44.73 SW1.P$4 SW1.P$3 | J7.1 31.11,51.77 31.56,51.32 35.38,51.32 36.02,51.96 | 36.02,51.96 36.02,53.17 J7.3 | J14.2 42.86,40.98 36.02,47.81 36.02,51.96 | SW1.P$3
N$1
  Top 0.61: J10.2 16.51,62.23 17.78,63.5 17.78,65.03 VR2.P$3 22.36,65.43 C3.P$1
N$2
  Top 0.254: SOC3.P$11 31.73,80.34 R5.P$1 32.7,80.32 33.66,81.28 J13.5
N$3
  Bottom 0.254: IC1.P$1 62.23,1.27 J17.1
N$4
  Top 0.254: R7.P$2 J13.1 | R7.P$2 | SOC3.P$16 29.74,87.84 30.8,88.9 30.8,91.43 R7.P$2
N$5  (via drill 0.55)
  Top 0.254: SOC3.P$15 30.46,86.34 33.02,88.9 J13.2 | v33.66,74.93 29.21,74.93 28.57,74.3 28.57,73.35 R8.P$2
  Bottom 0.254: J13.2 34.92,88.9 34.29,88.27 34.29,75.56 v33.66,74.93
N$6
  Top 0.61: R6.P$2 5.71,92.07 J12.4
  Bottom 0.254: SOC3.P$3 11.68,84.84 J12.4
N$7
  Bottom 0.254: SOC3.P$1 13.57,88.03 J12.6
N$8
  Bottom 0.254: SOC3.P$8 10.03,77.34 J11.1
N$9
  Bottom 0.254: SOC3.P$7 8.99,78.84 J11.2
N$10
  Bottom 0.254: SOC3.P$6 7.95,80.34 J11.3
N$11
  Bottom 0.254: SOC3.P$5 6.91,81.84 J11.4
N$12
  Top 0.61: J15.3 48.89,76.83 R9.P$2 Q1.1
N$14
  Top 0.254: SOC3.P$14 30.86,84.84 32.38,86.36 J13.3
N$15
  Top 0.254: SOC3.P$13 31.27,83.34 31.75,83.82 J13.4
N$17
  Top 0.61: LED2.A 30.7,71.65 R8.P$1
N$19
  Top 0.61: LED7.A 57.29,62.37 60.33,65.41 60.33,68.46 LED8.K
N$20
  Top 0.61: LED6.K 64.17,76.23 66.67,78.74 66.67,82.8 LED5.A
N$21
  Top 0.61: LED4.K 61.1,88.76 59.05,90.81 59.05,93.79 LED3.A
N$22
  Top 0.61: 55.93,74.08 LED7.K | 55.12,74.88 55.93,74.08 | 55.12,74.88 Q1.3 | LED5.K 64.13,82.28 55.93,74.08 | LED3.K 55.93,92.76 53.98,90.81 53.98,78.11 55.24,76.83 55.24,75.01 55.12,74.88
N$23
  Bottom 0.61: R10.P$1 56.52,78.74 63.5,71.75 63.5,68.07 LED8.A
N$25
  Top 0.254: 12.24,51.76 SW1.P$1 | 12.24,51.76 12.39,51.76 J9.1 | R4.P$1 15.24,48.76 12.24,51.76
  Bottom 0.61: SW1.P$1 SW1.P$2
N$26
  Top 0.254: J8.2 52.07,50.8 53.34,49.53 R2.P$1
N$27
  Top 0.254: R2.P$2 LED1.P$3
N$28
  Top 0.254: R3.P$2 62.23,45.72 LED1.P$1
N$29
  Top 0.254: J8.3 52.07,45.72 R3.P$1
N$30
  Top 0.254: J8.1 R1.P$1
N$31
  Top 0.254: R1.P$2 64.77,53.34 66.04,52.07 LED1.P$4
N$32
  Bottom 0.61: R11.P$1 62.87,79.38 65.41,79.38 66.67,78.11 66.67,75.32 LED6.A
N$33
  Bottom 0.61: R12.P$1 57.78,90.17 59.05,91.44 62.23,91.44 62.23,91.32 LED4.A
RX0
  Top 0.254: J1.10 6.35,15.24 SOC1.P$12
RX2
  Top 0.254: J1.4 6.35,30.48 SOC1.P$6
  Bottom 0.254: SOC3.P$2 12.09,86.34 12.06,86.36 J12.5 2.54,91.44 2.54,33.97 J1.4
TX0
  Top 0.254: J1.11 6.35,12.7 SOC1.P$13
TX2
  Top 0.254: SOC1.P$7 6.35,27.94 J1.5 2.22,32.07 2.22,86.04 J12.3
  Bottom 0.254: SOC3.P$4 10.64,83.34 J12.3 4.76,88.9
VN
  Top 0.254: J2.11 63.5,12.7 45.79,12.7 | 45.79,12.7 SOC1.P$18 | J14.13 45.79,12.7
VP
  Top 0.254: J2.12 63.5,10.16 SOC1.P$17 J14.14

### Text on the board
tPlace: RTS | TX | KEY | CTS | PIOO | RX | PIO1 | 3.3V | PIO2 | GND | PIO3 | RST | P2-1 | 3.3V | P2-2 | SIGNAL | GND | PIN2 | +5V | PIN3 | GND | A | C | GND | +5V | GND | GND | +5V | GND | B | G | R | 3.3V | GND | +5V | D15 | TX | D15 | RST | D13 | D13 | D2 | RX | D2 | D12 | EN | D12 | D4 | D8 | D0 | NC | D14 | D14 | RX2 | D7 | D4 | NC | D27 | D16 | TX2 | D6 | D5 | CLK | D26 | CH_PD | D5 | D5 | RXD | SD0 | D25 | ADC | D18 | 3.3V | TXD | CMD | D33 | RST | D19 | GND | Witty | SD1 | D32 | D21 | D4 | D35 | SD2 | RX0 | D3 | SD3 | D34 | TX0 | D2 | VN | RSV | D22 | D1 | RSV | VP | D23 | D0 | A0 | EN | 3.3V | GND | SIGNALS | LoLin
bPlace: Macedon Engineering | Ver 1A.0 | ESP Breakout Bd.